# EAGLE design QRE1113 Module Board (EAGLE 9.6.2)
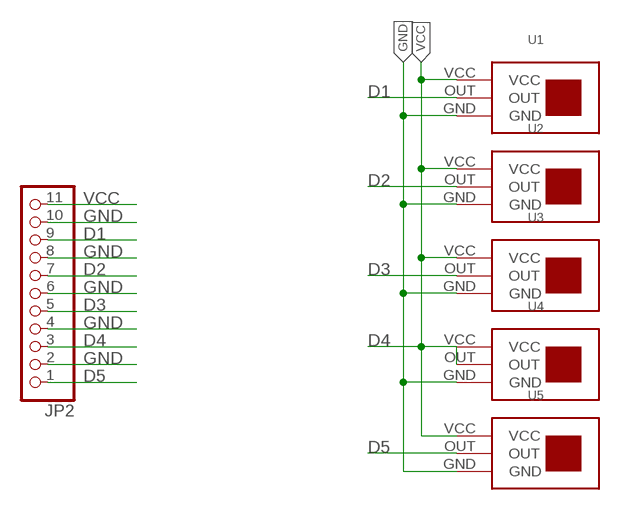
[diagram p0: schematic, sheet 1]

## Parts
JP2  PINHD-1X11/90  [1X11/90]
U1  QRE1113  [QRE1113]
U2  QRE1113  [QRE1113]
U3  QRE1113  [QRE1113]
U4  QRE1113  [QRE1113]
U5  QRE1113  [QRE1113]

## Nets
D1: JP2.9 U1.OUT
D2: JP2.7 U2.OUT
D3: JP2.5 U3.OUT
D4: JP2.3 U4.OUT
D5: JP2.1 U5.OUT
GND: JP2.2 JP2.4 JP2.6 JP2.8 JP2.10 U1.GND U2.GND U3.GND U4.GND U5.GND
VCC: JP2.11 U1.VCC U2.VCC U3.VCC U4.VCC U5.VCC

## Library data of the parts
JP2 = pinhead:PINHD-1X11: PIN HEADER
U1-U5 = IR Sensors:QRE1113

## Board
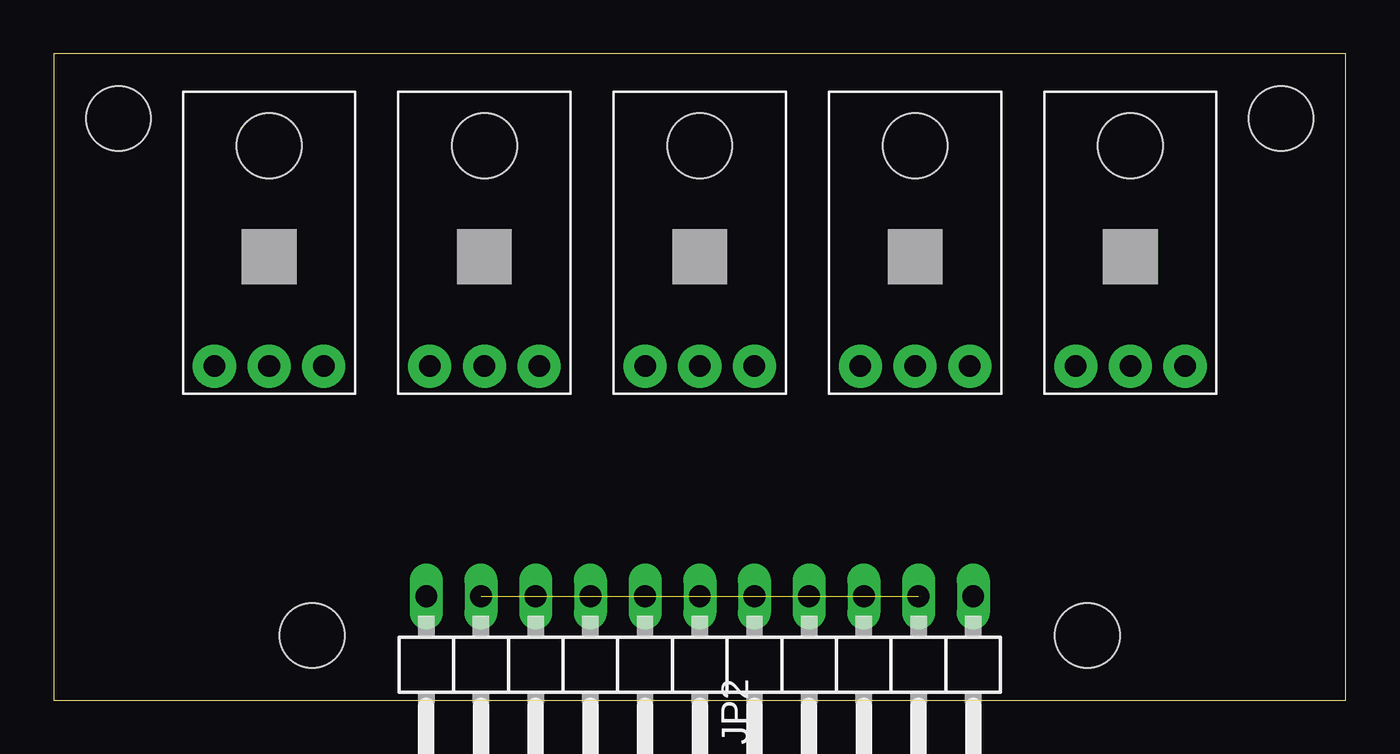
[diagram p1: board, top side]
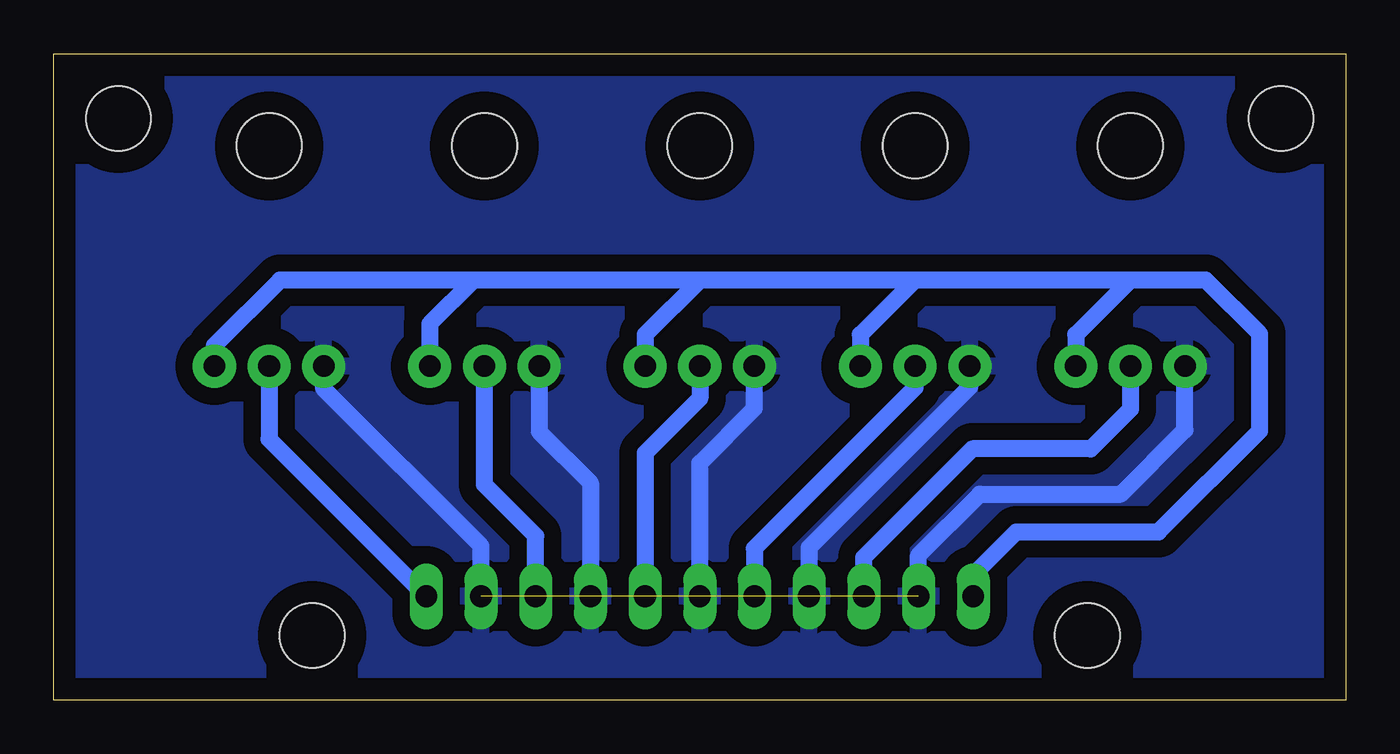
[diagram p2: board, bottom side, seen from below]

Size 60 x 30 mm. Coordinates in mm from the lower left corner, seen from the top.
Outline: 0,0 60,0 60,30 0,30 0,0
Copper layers (1*16): Top 0.035mm / dielectric 1.5mm / Bottom 0.035mm
Design rules "default *": minimum track width 0.8mm, minimum drill 0.7mm, track to track 0.8mm, track to pad 0.8mm, pad to pad 0.8mm, via to via 0.8mm, smd to smd 0.8mm, copper to edge 40mil, drill to drill 6mil, minimum pad ring 10mil, minimum via ring 8mil, stop-mask expansion 4mil, vias tented up to drill 0mil, thermal gap 10mil
Holes 3 mm at 12,3 48,3 57,27 3,27

### Footprints (pad centres in the part's own frame; a part is rotated, then mirrored left to right if it is on the bottom)
1X11/90 = drill 1.016 long: 1 -12.7,-3.81; 2 -10.16,-3.81; 3 -7.62,-3.81; 4 -5.08,-3.81; 5 -2.54,-3.81; 6 0,-3.81; 7 2.54,-3.81; 8 5.08,-3.81; 9 7.62,-3.81; 10 10.16,-3.81; 11 12.7,-3.81
QRE1113 = drill 1 pad 2: GND -2.54,0; OUT 0,0; VCC 2.54,0 | hole 3: 0,10.23

### Placement (x,y rotation side)
JP2  30,1 180 top
U1  10,15.5 0 top
U2  20,15.5 0 top
U3  30,15.5 0 top
U4  40,15.5 0 top
U5  50,15.5 0 top

### Tracks (layer width: path | path; a pad name or v marks a point on that pad's centre or on a via)
D1
  Bottom 0.8: U1.OUT 10,13.5 11.85,11.65 17.35,11.65 22.38,6.62 JP2.9
D2
  Bottom 0.8: U2.OUT 20,14.5 27.46,7.04 27.46,6 JP2.7
D3
  Bottom 0.8: U3.OUT 30,14 32.54,11.46 JP2.5
D4
  Bottom 0.8: JP2.3 37.62,7.62 40,10 U4.OUT
D5
  Bottom 0.8: U5.OUT 50,12.11 JP2.1
GND  (4 unrouted)
  Bottom 0.8: JP2.8 24.92,7.08 17.46,14.54 U2.GND | JP2.10 19.84,6.71 17,9.55 10.45,9.55 7.46,12.54 U1.GND | JP2.6 30,11 27.46,13.54 U3.GND | U4.GND 37.46,12.46 35.08,10.08 JP2.4 | JP2.2 40.16,7.16 47.46,14.46 U5.GND
  pour Bottom (isolate 0.8): 0,30 60,30 60,0 0,0
VCC
  Bottom 0.8: U5.VCC 52.54,16.46 49.5,19.5 40.5,19.5 | 10,19.5 6.5,19.5 4,17 4,12.5 8.69,7.81 15.3,7.81 17.3,5.81 JP2.11 | 10,19.5 20,19.5 | 20,19.5 30,19.5 | 30,19.5 40.5,19.5 | U1.VCC 12.54,16.96 10,19.5 | U2.VCC 22.54,16.96 20,19.5 | 30,19.5 32.54,16.96 U3.VCC | 40.5,19.5 42.54,17.46 U4.VCC